# EAGLE board EFP01 - Front Panel Board (EAGLE 7.4.0), part 1 of 2
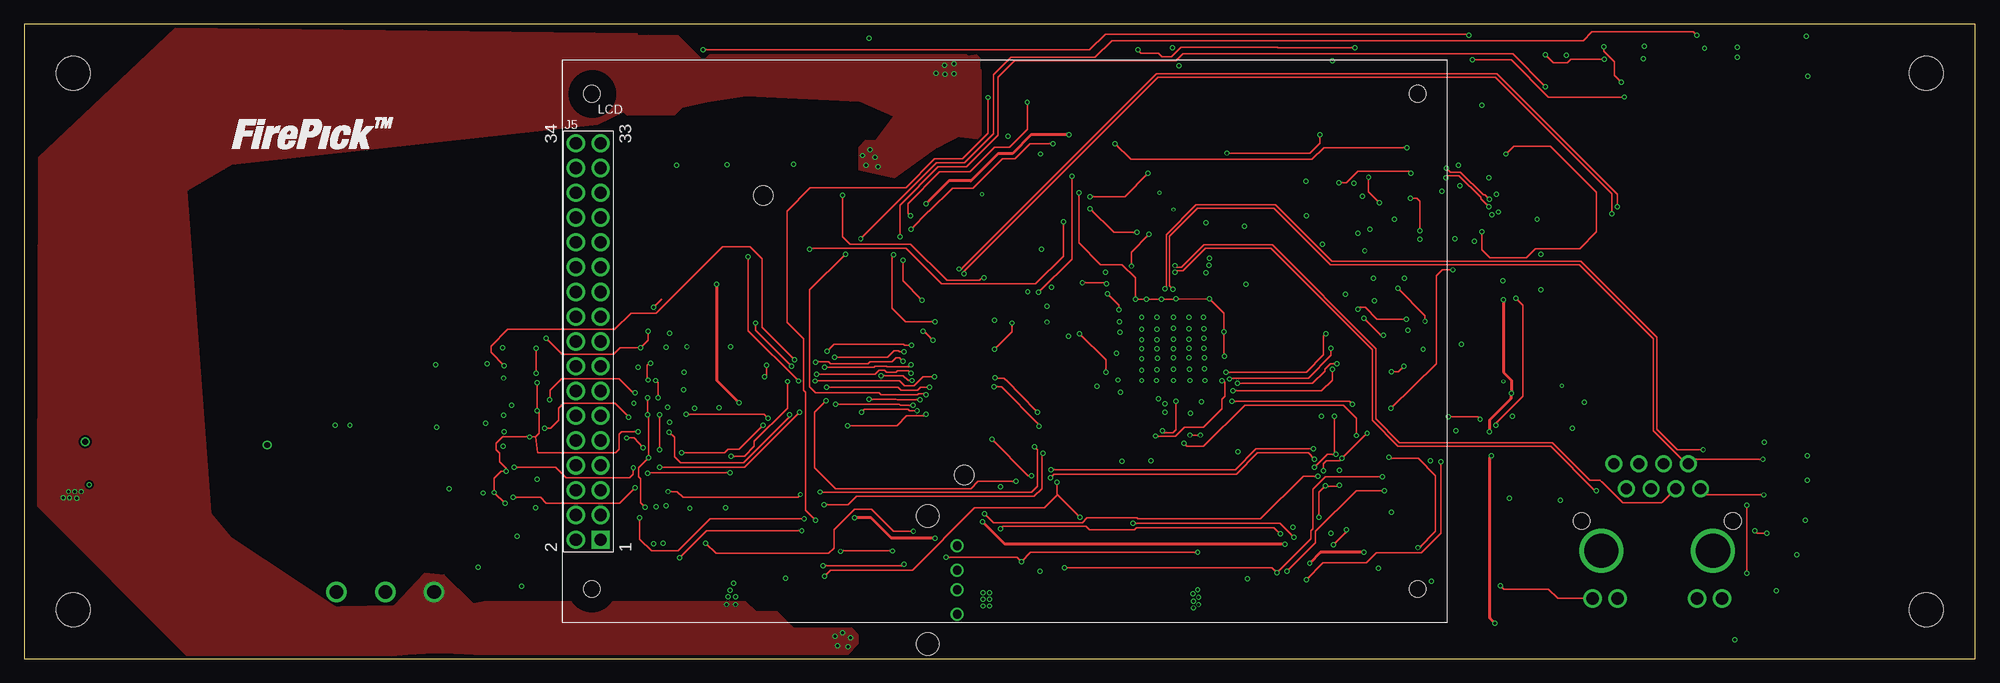
[diagram p2: board, top side]
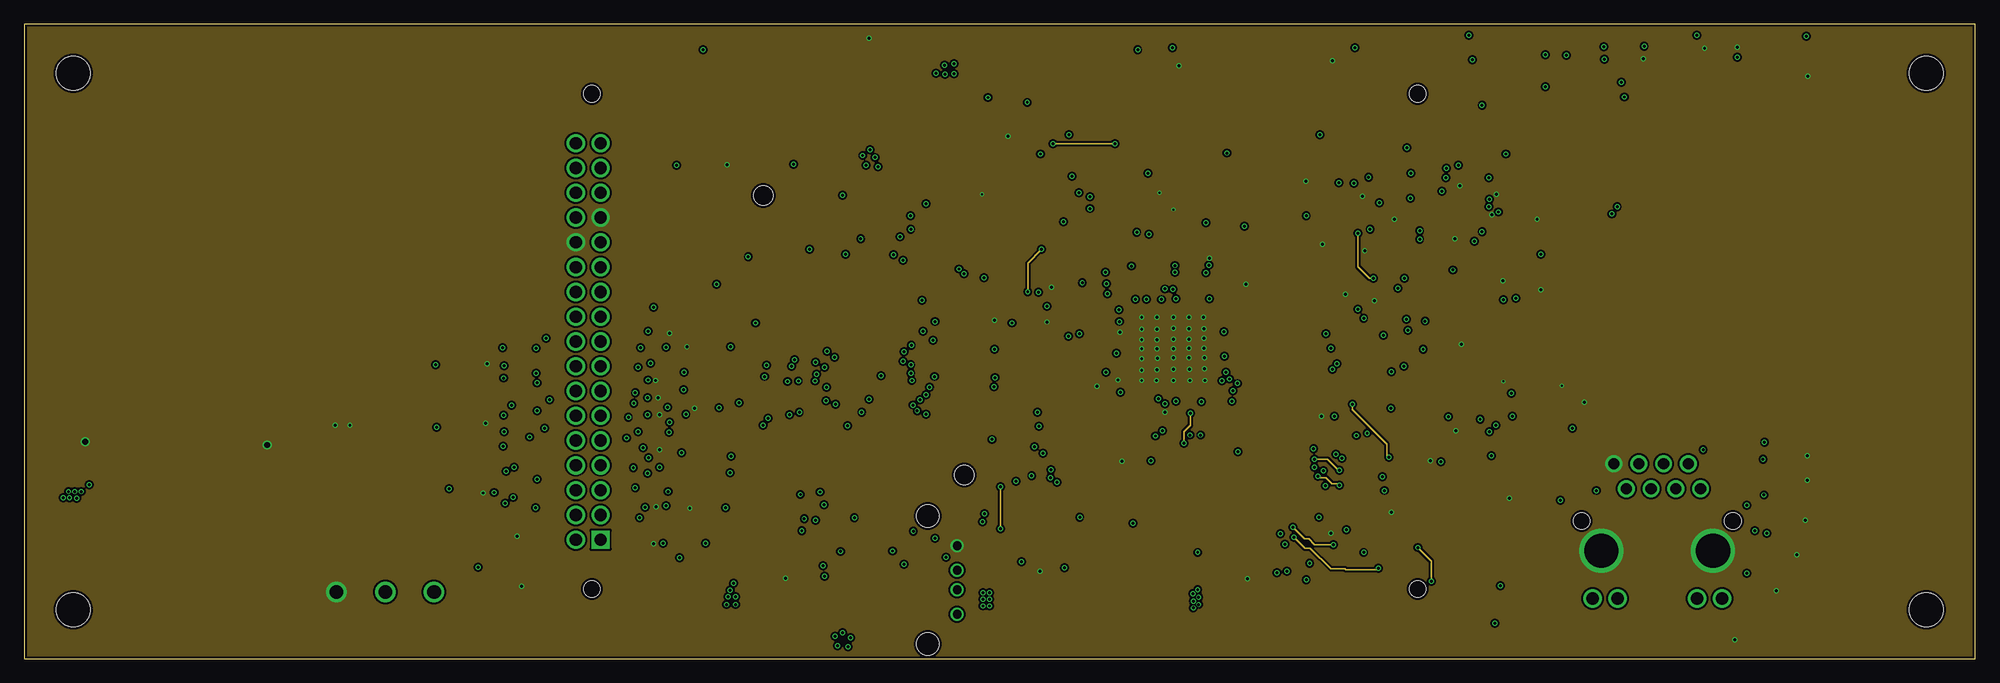
[diagram p3: board, inner layer Route2]
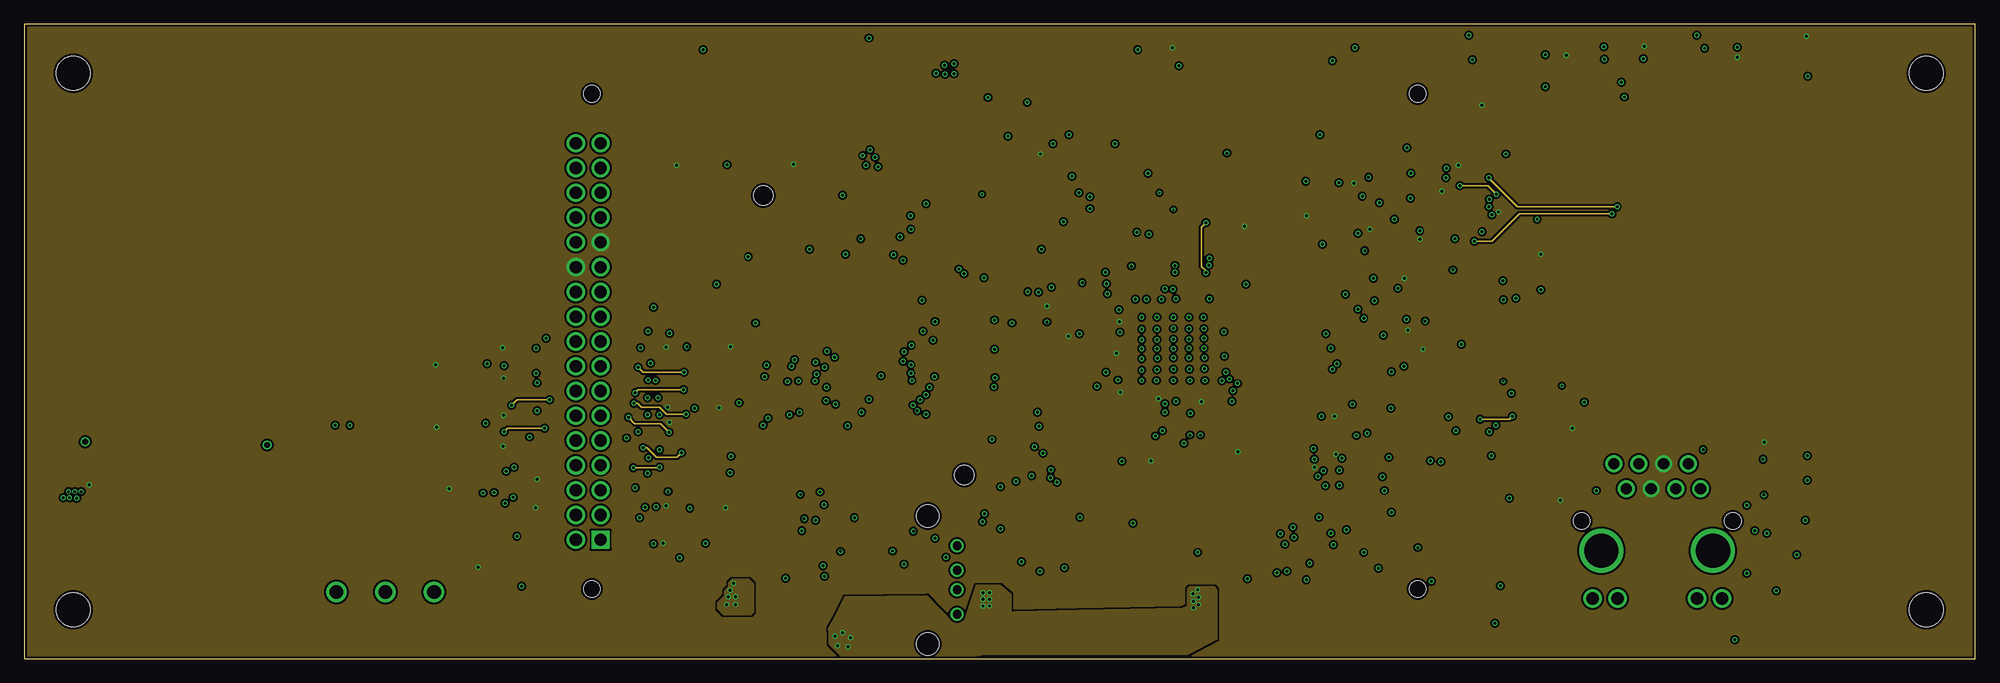
[diagram p4: board, inner layer Route15]
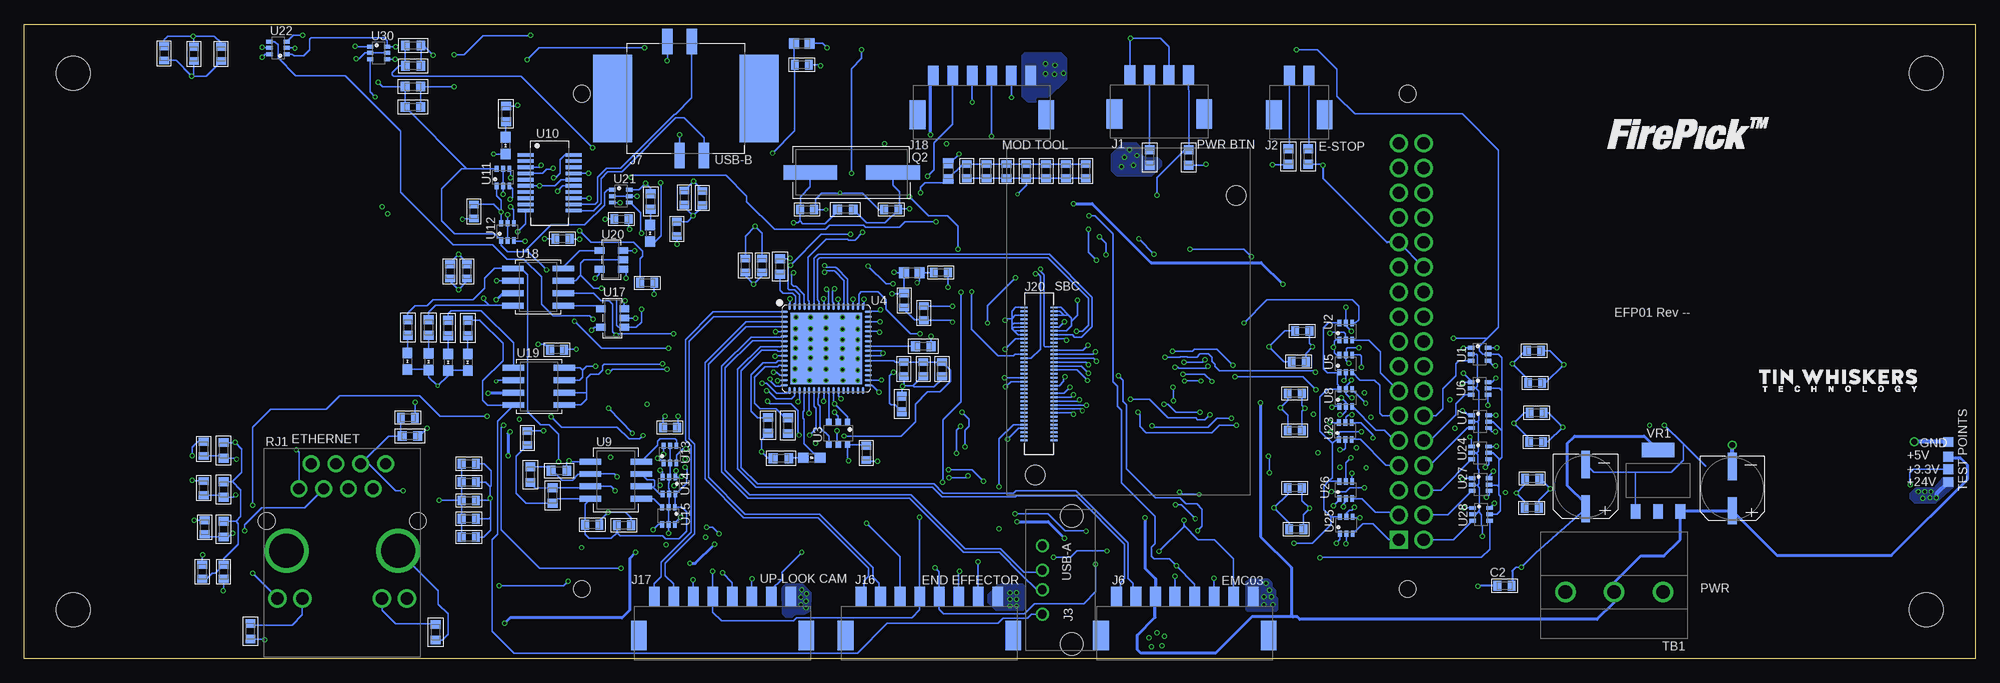
[diagram p5: board, bottom side, seen from below]

Size 200 x 65 mm. Coordinates in mm from the lower left corner, seen from the top.
Outline: 0,0 200,0 200,65 0,65 0,0
Copper layers (1*2*15*16): Top 0.035mm / dielectric 0.2mm / Route2 0.0175mm / dielectric 0.3mm / Route15 0.0175mm / dielectric 0.2mm / Bottom 0.035mm
Design rules "HQPCB_4layer_DRU_no_angle *": minimum track width 6mil, minimum drill 7mil, track to track 8mil, track to pad 8mil, pad to pad 6mil, via to via 8mil, smd to smd 0mil, copper to edge 10mil, drill to drill 8mil, minimum pad ring 6mil, minimum via ring 4mil, stop-mask expansion 2mil, vias tented up to drill 100mil, thermal gap 10mil
Net classes: 0 default: width 0.152 mm, drill 0.305 mm, clearance 0.152 mm
Holes 3.5 mm at 5,60 5,5 195,5 195,60
tRestrict: area 191.8,56.8 to 198.2,63.2; area 1.8,56.8 to 8.2,63.2; area 191.8,1.8 to 198.2,8.2; area 1.8,1.8 to 8.2,8.2; area 140.5,55.4 to 145.2,60.1; area 140.5,4.8 to 145.2,9.5; area 55.9,55.5 to 60.6,60.2; area 55.8,4.8 to 60.5,9.5
bRestrict: area 1.8,56.8 to 8.2,63.2; area 191.8,56.8 to 198.2,63.2; area 1.8,1.8 to 8.2,8.2; area 191.8,1.8 to 198.2,8.2; area 140.5,55.4 to 145.2,60.1; area 140.5,4.8 to 145.2,9.5; area 55.9,55.5 to 60.6,60.2; area 55.8,4.8 to 60.5,9.5

## Footprints (pad centres in the part's own frame; a part is rotated, then mirrored left to right if it is on the bottom)
C0603 = smd 0.8 x 1: 1 -0.725,0; 2 0.725,0
C-SMD-6.3MM = smd 0.9 x 2.8: NEG 0,-2.275; POS 0,2.275
F0603 = smd 1 x 1.1: 1 -0.8,0; 2 0.8,0
CON-JST-PH-2.0MM-4P-SMT-VRT = smd 1.1 x 2: 1 -3,0; 2 -1,0; 3 1,0; 4 3,0 | smd 1.6 x 3: NC1 -4.6,4; NC2 4.6,4
CON-JST-PH-2.0MM-2P-SMT-VRT = smd 1.1 x 2: 1 -1,0; 2 1,0 | smd 1.6 x 3: NC1 -2.6,4; NC2 2.6,4
USB-A-THRU-VERT-2.0 = drill 0.9: 1 -3.5,3; 2 -1,3; 3 1,3; 4 3.5,3 | hole 2.3: -6.57,0; 6.57,0
LCD-34P-3.2IN = drill 1.25 square: 1 -41.425,-20.32 | drill 1.25: 2 -43.965,-20.32; 3 -41.425,-17.78; 4 -43.965,-17.78; 5 -41.425,-15.24; 6 -43.965,-15.24; 7 -41.425,-12.7; 8 -43.965,-12.7; 9 -41.425,-10.16; 10 -43.965,-10.16; 11 -41.425,-7.62; 12 -43.965,-7.62; 13 -41.425,-5.08; 14 -43.965,-5.08; 15 -41.425,-2.54; 16 -43.965,-2.54; 17 -41.425,0; 18 -43.965,0; 19 -41.425,2.54; 20 -43.965,2.54; 21 -41.425,5.08; 22 -43.965,5.08; 23 -41.425,7.62; 24 -43.965,7.62; 25 -41.425,10.16; 26 -43.965,10.16; 27 -41.425,12.7; 28 -43.965,12.7; 29 -41.425,15.24; 30 -43.965,15.24; 31 -41.425,17.78; 32 -43.965,17.78; 33 -41.425,20.32; 34 -43.965,20.32 | hole 1.7: -42.325,25.39; -42.325,-25.39; 42.325,25.39; 42.325,-25.39
CON-JST-PH-2.0MM-8P-SMT-VRT = smd 1.1 x 2: 1 -7,0; 2 -5,0; 3 -3,0; 4 -1,0; 5 1,0; 6 3,0; 7 5,0; 8 7,0 | smd 1.6 x 3: NC1 -8.6,4; NC2 8.6,4
USB-B(SMT)-VERT-1734517 = smd 1.05 x 2.6: 1 8.14,5.85; 2 5.64,5.85; 3 6.89,-5.85; 4 9.39,-5.85 | smd 3.98 x 9: NC1 0,0; NC2 15.02,0
CON-JST-PH-2.00MM-6P-SMT-VRT = smd 1.1 x 2: 1 -5,0; 2 -3,0; 3 -1,0; 4 1,0; 5 3,0; 6 5,0 | smd 1.6 x 3: NC1 -6.6,4; NC2 6.6,4
DF40HC(3.0)-70DS-0.4V(51) = smd 0.2 x 0.7: 1 -6.8,-1.54; 2 -6.8,1.54; 3 -6.4,-1.54; 4 -6.4,1.54; 5 -6,-1.54; 6 -6,1.54; 7 -5.6,-1.54; 8 -5.6,1.54; 9 -5.2,-1.54; 10 -5.2,1.54; 11 -4.8,-1.54; 12 -4.8,1.54; 13 -4.4,-1.54; 14 -4.4,1.54; 15 -4,-1.54; 16 -4,1.54; 17 -3.6,-1.54; 18 -3.6,1.54; 19 -3.2,-1.54; 20 -3.2,1.54; 21 -2.8,-1.54; 22 -2.8,1.54; 23 -2.4,-1.54; 24 -2.4,1.54; 25 -2,-1.54; 26 -2,1.54; 27 -1.6,-1.54; 28 -1.6,1.54; 29 -1.2,-1.54; 30 -1.2,1.54; 31 -0.8,-1.54; 32 -0.8,1.54; 33 -0.4,-1.54; 34 -0.4,1.54; 35 0,-1.54; 36 0,1.54; 37 0.4,-1.54; 38 0.4,1.54; 39 0.8,-1.54; 40 0.8,1.54; 41 1.2,-1.54; 42 1.2,1.54; 43 1.6,-1.54; 44 1.6,1.54; 45 2,-1.54; 46 2,1.54; 47 2.4,-1.54; 48 2.4,1.54; 49 2.8,-1.54; 50 2.8,1.54; 51 3.2,-1.54; 52 3.2,1.54; 53 3.6,-1.54; 54 3.6,1.54; 55 4,-1.54; 56 4,1.54; 57 4.4,-1.54; 58 4.4,1.54; 59 4.8,-1.54; 60 4.8,1.54; 61 5.2,-1.54; 62 5.2,1.54; 63 5.6,-1.54; 64 5.6,1.54; 65 6,-1.54; 66 6,1.54; 67 6.4,-1.54; 68 6.4,1.54; 69 6.8,-1.54; 70 6.8,1.54 | hole 2: 10.39,-0.37; -18.3,20.23
LED0603 = smd 1.1 x 1: A -0.85,0; C 0.85,0
HC-49/U-S = smd 5.5 x 1.5: 1 -4.25,0; 2 4.25,0
R0603 = smd 0.9 x 1: 1 -0.8,0; 2 0.8,0
MAGJACK(HR911105A) = drill 1.15: 1 4.44,-6.35; 2 3.18,-8.89; 3 1.9,-6.35; 4 0.64,-8.89; 5 -0.64,-6.35; 6 -1.9,-8.89; 7 -3.18,-6.35; 8 -4.44,-8.89 | drill 1.27: 9 6.625,4.9; 10 4.085,4.9; 11 -4.085,4.9; 12 -6.625,4.9 | drill 3.5: SHLD0 5.715,0; SHLD1 -5.715,0 | hole 1.7: -7.745,-3.05; 7.745,-3.05
TBLOCK-3-5MM-OSTTH030160 = drill 1.4: 1 -5,0; 2 0,0; 3 5,0
TESTPAD = smd 1 x 1: PAD 0,0
SOT-363 = smd 0.4 x 0.65: 1 -0.65,-0.875; 2 0,-0.875; 3 0.65,-0.875; 4 0.65,0.875; 5 0,0.875; 6 -0.65,0.875
SOT-23-6 = smd 0.55 x 0.65: 1 0.95,1.175; 2 0,1.175; 3 -0.95,1.175; 4 -0.95,-1.175; 5 0,-1.175; 6 0.95,-1.175
64-QFN = smd 0.7 x 0.25: 1 -4.31,3.75; 2 -4.31,3.25; 3 -4.31,2.75; 4 -4.31,2.25; 5 -4.31,1.75; 6 -4.31,1.25; 7 -4.31,0.75; 8 -4.31,0.25; 9 -4.31,-0.25; 10 -4.31,-0.75; 11 -4.31,-1.25; 12 -4.31,-1.75; 13 -4.31,-2.25; 14 -4.31,-2.75; 15 -4.31,-3.25; 16 -4.31,-3.75; 33 4.31,-3.75; 34 4.31,-3.25; 35 4.31,-2.75; 36 4.31,-2.25; 37 4.31,-1.75; 38 4.31,-1.25; 39 4.31,-0.75; 40 4.31,-0.25; 41 4.31,0.25; 42 4.31,0.75; 43 4.31,1.25; 44 4.31,1.75; 45 4.31,2.25; 46 4.31,2.75; 47 4.31,3.25; 48 4.31,3.75 | smd 0.25 x 0.7: 17 -3.75,-4.31; 18 -3.25,-4.31; 19 -2.75,-4.31; 20 -2.25,-4.31; 21 -1.75,-4.31; 22 -1.25,-4.31; 23 -0.75,-4.31; 24 -0.25,-4.31; 25 0.25,-4.31; 26 0.75,-4.31; 27 1.25,-4.31; 28 1.75,-4.31; 29 2.25,-4.31; 30 2.75,-4.31; 31 3.25,-4.31; 32 3.75,-4.31; 49 3.75,4.31; 50 3.25,4.31; 51 2.75,4.31; 52 2.25,4.31; 53 1.75,4.31; 54 1.25,4.31; 55 0.75,4.31; 56 0.25,4.31; 57 -0.25,4.31; 58 -0.75,4.31; 59 -1.25,4.31; 60 -1.75,4.31; 61 -2.25,4.31; 62 -2.75,4.31; 63 -3.25,4.31; 64 -3.75,4.31 | smd 7.3 x 7.3: PAD 0,0
SOICN-8 = smd 2.2 x 0.6: 1 -2.6,1.905; 2 -2.6,0.635; 3 -2.6,-0.635; 4 -2.6,-1.905; 5 2.6,-1.905; 6 2.6,-0.635; 7 2.6,0.635; 8 2.6,1.905
20-SSOP = smd 1.651 x 0.381: 1 -2.477,2.857; 2 -2.477,2.223; 3 -2.477,1.587; 4 -2.477,0.953; 5 -2.477,0.318; 6 -2.477,-0.318; 7 -2.477,-0.953; 8 -2.477,-1.587; 9 -2.477,-2.223; 10 -2.477,-2.857; 11 2.477,-2.857; 12 2.477,-2.223; 13 2.477,-1.587; 14 2.477,-0.953; 15 2.477,-0.318; 16 2.477,0.318; 17 2.477,0.953; 18 2.477,1.587; 19 2.477,2.223; 20 2.477,2.857
SOT-23-5 = smd 0.7 x 1: 1 0.95,1.2; 2 0,1.2; 3 -0.95,1.2; 4 -0.95,-1.2; 5 0.95,-1.2
SOIC-8 = smd 2.2 x 0.6: 1 -2.6,1.905; 2 -2.6,0.635; 3 -2.6,-0.635; 4 -2.6,-1.905; 5 2.6,-1.905; 6 2.6,-0.635; 7 2.6,0.635; 8 2.6,1.905
SOT-223 = smd 1 x 1.5: 1 -2.3,-3.15; 2 0,-3.15; 3 2.3,-3.15 | smd 3.3 x 1.5: P$1 0,3.15

## Placement (x,y rotation side)
C1  0.1uF  [C0603]  45.21,31.55 0 bottom
C2  0.1uF  [C0603]  48.25,7.45 0 bottom
C3  10uF  [C-SMD-6.3MM]  24.89,17.42 180 bottom
C4  10uF  [C-SMD-6.3MM]  39.93,17.63 180 bottom
C5  0.1uF  [C0603]  45.11,28.24 0 bottom
C6  0.1uF  [C0603]  107.8,35.41 90 bottom
C7  0.1uF  [C0603]  126.09,40.28 90 bottom
C8  0.1uF  [C0603]  124.36,40.28 90 bottom
C9  0.1uF  [C0603]  179.83,61.98 90 bottom
C10  0.1uF  [C0603]  182.63,61.98 90 bottom
C11  33pF  [C0603]  111.12,46.02 0 bottom
C12  33pF  [C0603]  119.76,46.02 180 bottom
C13  0.1uF  [C0603]  103.38,49.96 90 bottom
C14  0.1uF  [C0603]  101.35,49.96 90 bottom
C15  0.1uF  [C0603]  185.67,62.03 90 bottom
C16  0.1uF  [C0603]  113.69,21.08 90 bottom
C17  0.1uF  [C0603]  156.36,39.67 90 bottom
C18  0.1uF  [C0603]  99.31,49.96 90 bottom
C19  0.1uF  [C0603]  97.28,49.96 90 bottom
C20  0.1uF  [C0603]  95.25,49.96 90 bottom
C21  0.1uF  [C0603]  93.22,49.96 90 bottom
C22  0.1uF  [C0603]  91.19,49.96 90 bottom
C23  0.1uF  [C0603]  154.43,12.45 180 bottom
C24  0.1uF  [C0603]  179.58,8.89 90 bottom
C25  0.1uF  [C0603]  181.76,8.89 270 bottom
C26  18pF  [C0603]  181.61,17.48 270 bottom
C27  0.1uF  [C0603]  144.83,43.03 0 bottom
C28  0.1uF  [C0603]  154.64,39.67 90 bottom
C29  0.1uF  [C0603]  145.39,31.65 0 bottom
C30  18pF  [C0603]  181.61,21.49 270 bottom
C31  18pF  [C0603]  181.51,13.46 270 bottom
C32  18pF  [C0603]  160.68,24.69 180 bottom
C33  0.1uF  [C0603]  148.44,22.61 270 bottom
C34  0.1uF  [C0603]  133.81,23.67 180 bottom
C35  0.1uF  [C0603]  138.53,13.67 180 bottom
C36  0.1uF  [C0603]  141.78,13.72 180 bottom
C37  0.1uF  [C0603]  44.96,25.2 0 bottom
C38  0.1uF  [C0603]  45.01,22.2 0 bottom
C39  0.1uF  [C0603]  45.42,18.44 0 bottom
C40  0.1uF  [C0603]  45.47,15.44 0 bottom
C41  0.1uF  [C0603]  68.99,33.58 180 bottom
C42  0.1uF  [C0603]  69.34,30.43 180 bottom
C43  0.1uF  [C0603]  69.75,27.18 180 bottom
C44  0.1uF  [C0603]  69.75,23.37 180 bottom
C45  0.1uF  [C0603]  69.75,17.48 180 bottom
C46  0.1uF  [C0603]  69.6,13.26 180 bottom
C47  0.1uF  [C0603]  133.1,44.04 90 bottom
C48  0.1uF  [C0603]  138.79,45.06 0 bottom
C49  0.1uF  [C0603]  153.92,45.82 90 bottom
C60  0.1uF  [C0603]  132.33,47.24 270 bottom
C61  4.7uF  [C0603]  130.51,47.19 270 bottom
C73  1.0uF  [C0603]  106.05,39.57 180 bottom
C74  0.1uF  [C0603]  109.8,36.7 90 bottom
C77  0.1uF  [C0603]  136.14,38.51 180 bottom
C78  10nF  [C0603]  120.29,60.86 180 bottom
C79  0.1uF  [C0603]  154.43,14.33 180 bottom
C80  0.1uF  [C0603]  154.43,16.21 180 bottom
C81  0.1uF  [C0603]  154.43,18.08 180 bottom
C82  0.1uF  [C0603]  154.43,19.96 180 bottom
C83  4.7uF  [C0603]  109.83,29.67 90 bottom
C84  0.1uF  [C0603]  107.85,29.67 90 bottom
C85  0.1uF  [C0603]  105.92,29.67 90 bottom
FB1  120R  [F0603]  105.28,49.96 90 bottom
FB3  120R  [F0603]  120.29,63.04 0 bottom
FB4  120R  [F0603]  109.02,39.55 180 bottom
J1  PWRBTN  [CON-JST-PH-2.0MM-4P-SMT-VRT]  83.64,59.82 180 bottom
J2  ESTOP  [CON-JST-PH-2.0MM-2P-SMT-VRT]  69.29,59.74 180 bottom
J3  USB-A(2.0)  [USB-A-THRU-VERT-2.0]  92.63,8.05 90 bottom
J5  LCD  [LCD-34P-3.2IN]  100.51,32.5 0 top
J6  S8B-PH-SM4  [CON-JST-PH-2.0MM-8P-SMT-VRT]  81.03,6.35 180 bottom
J7  USB-B  [USB-B(SMT)-VERT-1734517]  124.69,57.4 180 bottom
J16  S8B-PH-SM4  [CON-JST-PH-2.0MM-8P-SMT-VRT]  107.21,6.35 180 bottom
J17  S8B-PH-SM4  [CON-JST-PH-2.0MM-8P-SMT-VRT]  128.42,6.35 180 bottom
J18  S6B-PH-SM4  [CON-JST-PH-2.00MM-6P-SMT-VRT]  101.83,59.74 180 bottom
J20  Intel EDISON  [DF40HC(3.0)-70DS-0.4V(51)]  95.98,29.18 270 bottom
LED8  GREEN  [LED0603]  135.84,43.59 270 bottom
LED9  GREEN  [LED0603]  150.67,52.58 270 bottom
LED10  GREEN  [LED0603]  156.57,30.38 270 bottom
LED11  GREEN  [LED0603]  119.28,20.57 0 bottom
LED12  GREEN  [LED0603]  154.53,30.38 270 bottom
LED13  GREEN  [LED0603]  160.73,30.48 270 bottom
LED14  GREEN  [LED0603]  158.55,30.43 270 bottom
LOGO1  LOGO-FIREPICKLARGE  [LOGO-FIREPICK]  21.08,50.5 0 top
LOGO2  LOGO-FIREPICKLARGE  [LOGO-FIREPICK]  37.9,50.5 0 bottom
Q2  25MHz  [HC-49/U-S]  115.19,49.83 180 bottom
R1  4.7K  [R0603]  70.41,51.46 90 bottom
R2  10K  [R0603]  68.38,51.46 270 bottom
R3  ORNG  [R0603]  84.63,51.36 270 bottom
R10  330R  [R0603]  122.43,20.52 180 bottom
R11  1M  [R0603]  115.82,46.02 180 bottom
R12  825R  [R0603]  123.75,23.9 270 bottom
R13  12.4K 1%  [R0603]  110.03,26.09 270 bottom
R14  10K  [R0603]  107.85,32 0 bottom
R15  0R1  [R0603]  160.14,62.84 0 bottom
R16  DNP  [R0603]  160.14,60.75 0 bottom
R22  49R9  [R0603]  179.58,17.32 90 bottom
R30  49R9  [R0603]  179.58,21.34 90 bottom
R31  49R9  [R0603]  179.58,13.26 90 bottom
R32  49R9  [R0603]  160.48,22.81 0 bottom
R33  330R  [R0603]  157.84,2.69 270 bottom
R34  330R  [R0603]  176.83,2.79 270 bottom
R35  12K 1%  [R0603]  122.53,40.18 270 bottom
R36  0R  [R0603]  121.72,23.88 90 bottom
R37  511R  [R0603]  156.57,33.88 90 bottom
R48  10K  [R0603]  80.62,51.36 270 bottom
R49  1K  [R0603]  145.85,16.71 270 bottom
R50  1K  [R0603]  145.19,19.25 180 bottom
R51  120R  [R0603]  148.13,18.85 270 bottom
R52  511R  [R0603]  154.53,33.88 90 bottom
R53  270R  [R0603]  135.79,46.84 90 bottom
R54  270R  [R0603]  150.62,55.83 90 bottom
R55  511R  [R0603]  160.68,33.93 90 bottom
R56  511R  [R0603]  158.55,33.93 90 bottom
R57  0R1  [R0603]  160.17,58.62 0 bottom
R58  DNP  [R0603]  160.17,56.54 0 bottom
RJ1  HR911105A  [MAGJACK(HR911105A)]  167.41,11.06 180 bottom
TB1  DCIN  [TBLOCK-3-5MM-OSTTH030160]  37.01,6.82 0 bottom
TP1  +3.3V  [TESTPAD]  2.74,19.41 90 bottom
TP2  +5V  [TESTPAD]  2.74,20.68 90 bottom
TP3  +5V  [TESTPAD]  2.74,18.08 270 bottom
TP4  GND  [TESTPAD]  2.74,22.2 90 bottom
U1  74LVC1T45  [SOT-363]  50.8,31.19 270 bottom
U2  74LVC1T45  [SOT-363]  64.52,33.53 0 bottom
U3  93LC66A  [SOT-23-6]  116.56,23.09 0 bottom
U4  LAN9514  [64-QFN]  117.78,31.78 0 bottom
U5  74LVC1T45  [SOT-363]  64.52,30.23 0 bottom
U6  74LVC1T45  [SOT-363]  50.8,27.69 270 bottom
U7  74LVC1T45  [SOT-363]  50.75,24.28 270 bottom
U8  74LVC1T45  [SOT-363]  64.52,26.72 0 bottom
U9  SP3485  [SOICN-8]  139.36,18.28 180 bottom
U10  FT231XS-R  [20-SSOP]  146.15,48.77 0 bottom
U11  74LVC1T45  [SOT-363]  150.93,49.33 0 bottom
U12  74LVC1T45  [SOT-363]  150.47,43.74 0 bottom
U13  74LVC1T45  [SOT-363]  133.81,20.93 0 bottom
U14  74LVC1T45  [SOT-363]  133.91,17.73 180 bottom
U15  74LVC1T45  [SOT-363]  133.96,14.63 180 bottom
U17  OR  [SOT-23-5]  139.7,34.9 270 bottom
U18  MIC2026-1YM  [SOIC-8]  147.32,38.07 180 bottom
U19  MIC2026-1YM  [SOIC-8]  147.24,27.89 180 bottom
U20  OR  [SOT-23-5]  139.83,40.87 270 bottom
U21  74LVC1T45  [SOT-363]  138.84,47.4 270 bottom
U22  74LVC1T45  [SOT-363]  173.99,62.59 90 bottom
U23  74LVC1T45  [SOT-363]  64.57,23.32 0 bottom
U24  74LVC1T45  [SOT-363]  50.75,21.08 270 bottom
U25  74LVC1T45  [SOT-363]  64.47,13.67 0 bottom
U26  74LVC1T45  [SOT-363]  64.52,17.27 0 bottom
U27  74LVC1T45  [SOT-363]  50.7,17.83 270 bottom
U28  74LVC1T45  [SOT-363]  50.65,14.78 270 bottom
U30  74LVC1T45  [SOT-363]  163.68,62.08 270 bottom
U$1  TIN-WHISKERSTSTOP  [TIN-WHISKERS-TSTOP]  21.77,26.84 0 bottom
VR1  LMS8117AMP-3.3/NOPB  [SOT-223]  32.51,18.24 0 bottom